# EAGLE design weatherstationv3 (EAGLE 6.0)
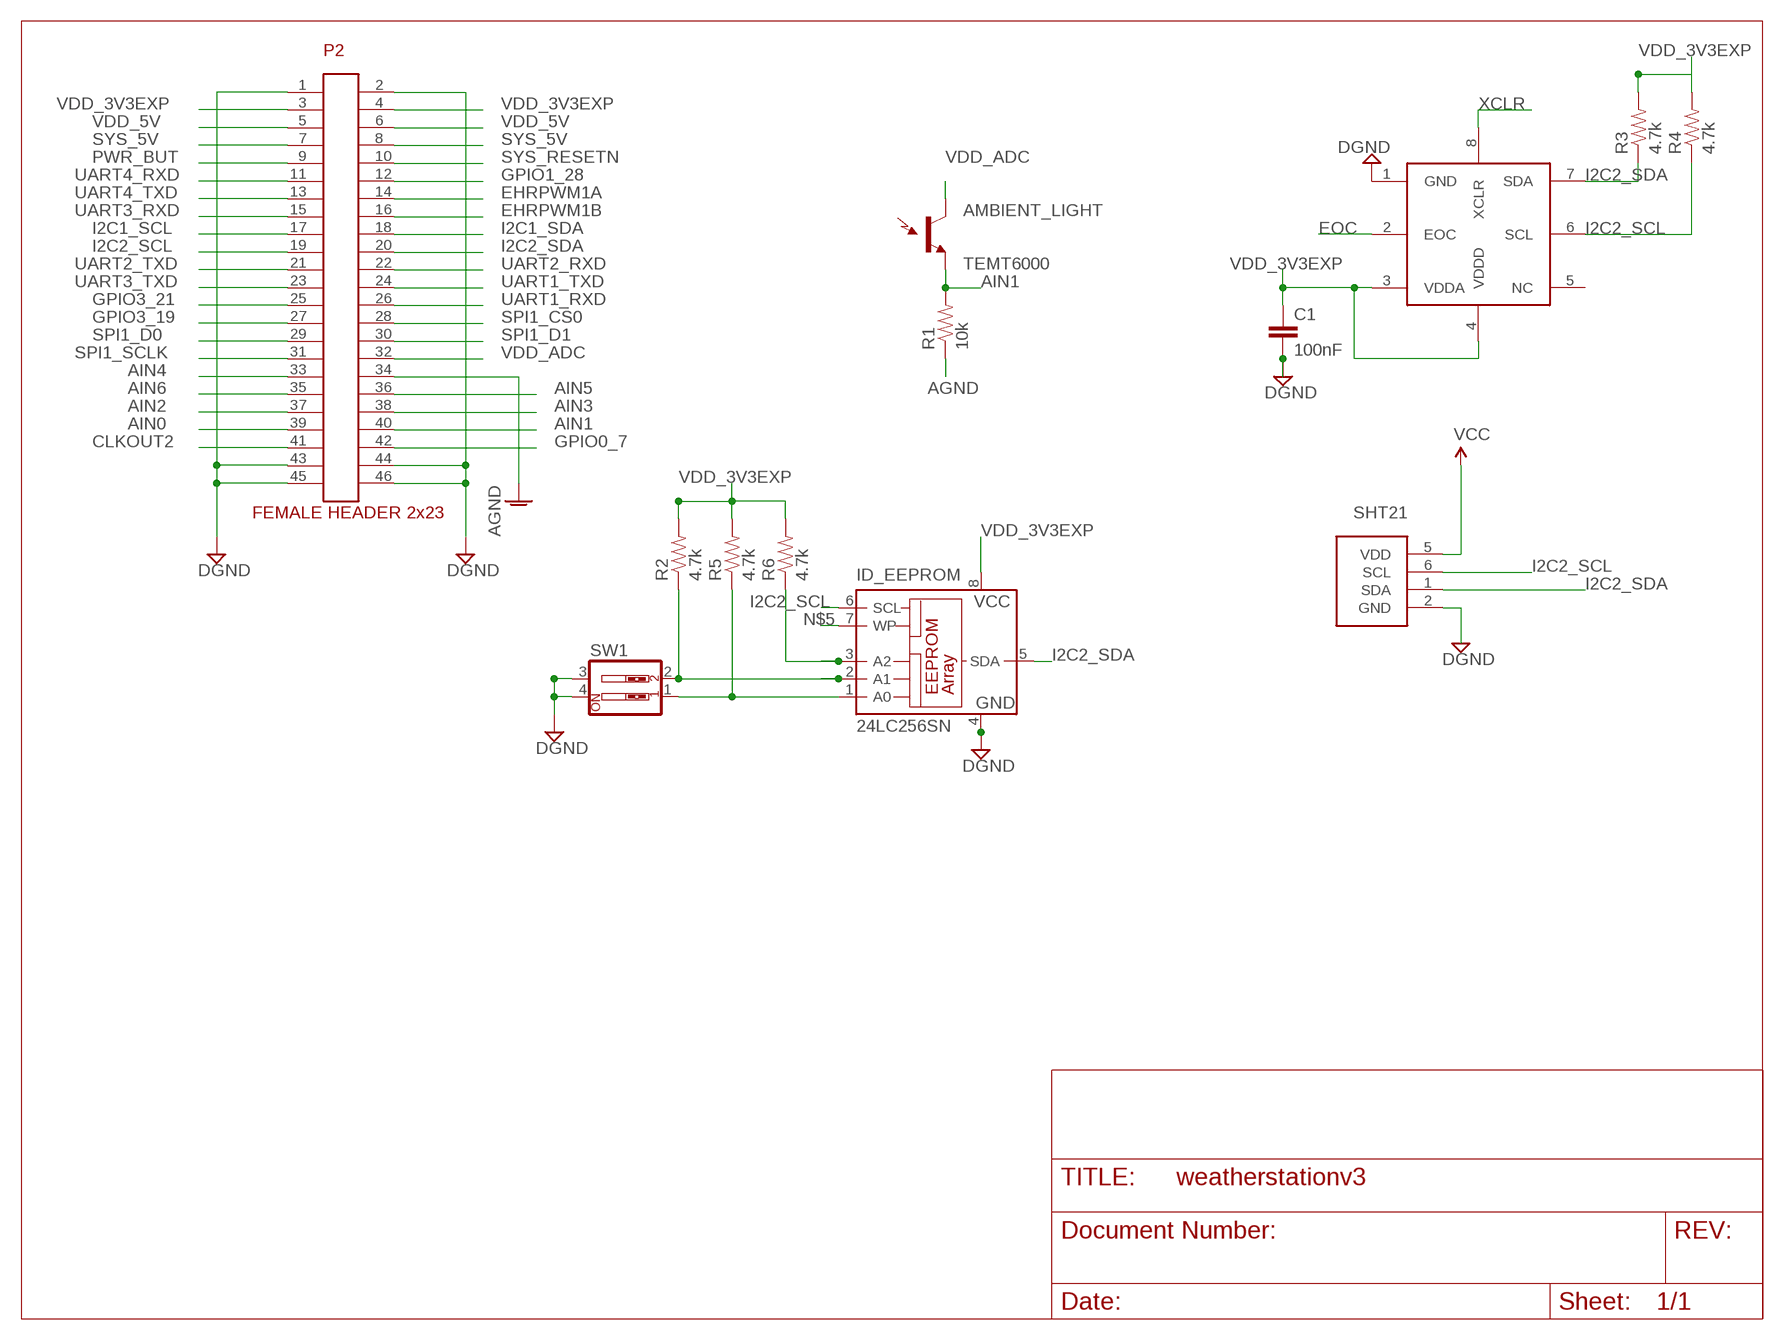
[diagram p0: schematic, sheet 1]

## Parts
AMBIENT_LIGHT  TEMT6000  [TEMT6000-SEN]
BAROMETRIC_PRESSURE  BMP085  [BMP085]
C1  100nF  CAP0603-CAP  [0603-CAP]
ID_EEPROM  24LC256SN  [SO-08]
P2  CONN23-2FB  [CONN23-2F]
R1  10k  RESISTOR0805-RES  [0805]
R2  4.7k  RESISTOR0603-RES  [0603-RES]
R3  4.7k  RESISTOR0603-RES  [0603-RES]
R4  4.7k  RESISTOR0603-RES  [0603-RES]
R5  4.7k  RESISTOR0603-RES  [0603-RES]
R6  4.7k  RESISTOR0603-RES  [0603-RES]
SHT21  SHT21  [SHT21]
SW1  SW_DIP-2  [DIPSWITCH-02]

## Nets
AGND: P2.34 R1.1
AIN0: P2.39
AIN1: AMBIENT_LIGHT.EMITTER(E1) P2.40 R1.2
AIN2: P2.37
AIN3: P2.38
AIN4: P2.33
AIN5: P2.36
AIN6: P2.35
CLKOUT2: P2.41
DGND [power]: BAROMETRIC_PRESSURE.1(GND) C1.2 P2.1 P2.2 P2.43 P2.44 P2.45 P2.46 SHT21.2(GND) SW1.3 SW1.4
EHRPWM1A: P2.14
EHRPWM1B: P2.16
EOC: BAROMETRIC_PRESSURE.2(EOC)
GPIO0_7: P2.42
GPIO1_28: P2.12
GPIO3_19: P2.27
GPIO3_21: P2.25
I2C1_SCL: P2.17
I2C1_SDA: P2.18
I2C2_SCL: BAROMETRIC_PRESSURE.6(SCL) ID_EEPROM.6(SCL) P2.19 R4.1 SHT21.6(SCL)
I2C2_SDA: BAROMETRIC_PRESSURE.7(SDA) ID_EEPROM.5(SDA) P2.20 R3.1 SHT21.1(SDA)
N$1: ID_EEPROM.1(A0) R5.1 SW1.1
N$5: ID_EEPROM.7(WP)
N$6: ID_EEPROM.3(A2) R6.1
N$7: ID_EEPROM.2(A1) R2.1 SW1.2
PWR_BUT: P2.9
SPI1_CS0: P2.28
SPI1_D0: P2.29
SPI1_D1: P2.30
SPI1_SCLK: P2.31
SYS_5V: P2.7 P2.8
SYS_RESETN: P2.10
UART1_RXD: P2.26
UART1_TXD: P2.24
UART2_RXD: P2.22
UART2_TXD: P2.21
UART3_RXD: P2.15
UART3_TXD: P2.23
UART4_RXD: P2.11
UART4_TXD: P2.13
VDD_3V3EXP [power]: BAROMETRIC_PRESSURE.3(VDDA) BAROMETRIC_PRESSURE.4(VDDD) C1.1 ID_EEPROM.8(VCC) P2.3 P2.4 R2.2 R3.2 R4.2 R5.2 R6.2 SHT21.5(VDD) ; supply symbol labelled VCC
VDD_5V: P2.5 P2.6
VDD_ADC [power]: AMBIENT_LIGHT.COLLECTOR(C1) P2.32
XCLR: BAROMETRIC_PRESSURE.8(XCLR)
Unconnected: BAROMETRIC_PRESSURE.5(NC)

## Power pins joined to a net without a drawn wire
DGND: ID_EEPROM.4(GND)

## Library data of the parts
AMBIENT_LIGHT = SparkFun:TEMT6000: Ambient Light Sensor Simple light detection sensor. Output varies with light intensity input. Spark Fun Electronics SKU : COM-08348
BAROMETRIC_PRESSURE = SparkFun:BMP085
C1 = SparkFun:CAP: Capacitor Standard 0603 ceramic capacitor, and 0.1" leaded capacitor.
ID_EEPROM = microchip:24*: Serial EEPROM I2C; MF: MICROCHIP; MPN: 24LC256-I/SN; OC_FARNELL: 9757996; OC_NEWARK: 27C9144
P2 = conn23-2f:CONN23-2FB: CONN23-2FB 2x23 pin female header
R1-R6 = SparkFun:RESISTOR: Resistor Basic schematic elements and footprints for 0603, 1206, and PTH resistors.
SHT21 = ALX:SHT21
SW1 = SparkFun:SW_DIP-2: DIP SWITCH

## Net classes
1 power: width 0.61 mm

## Board
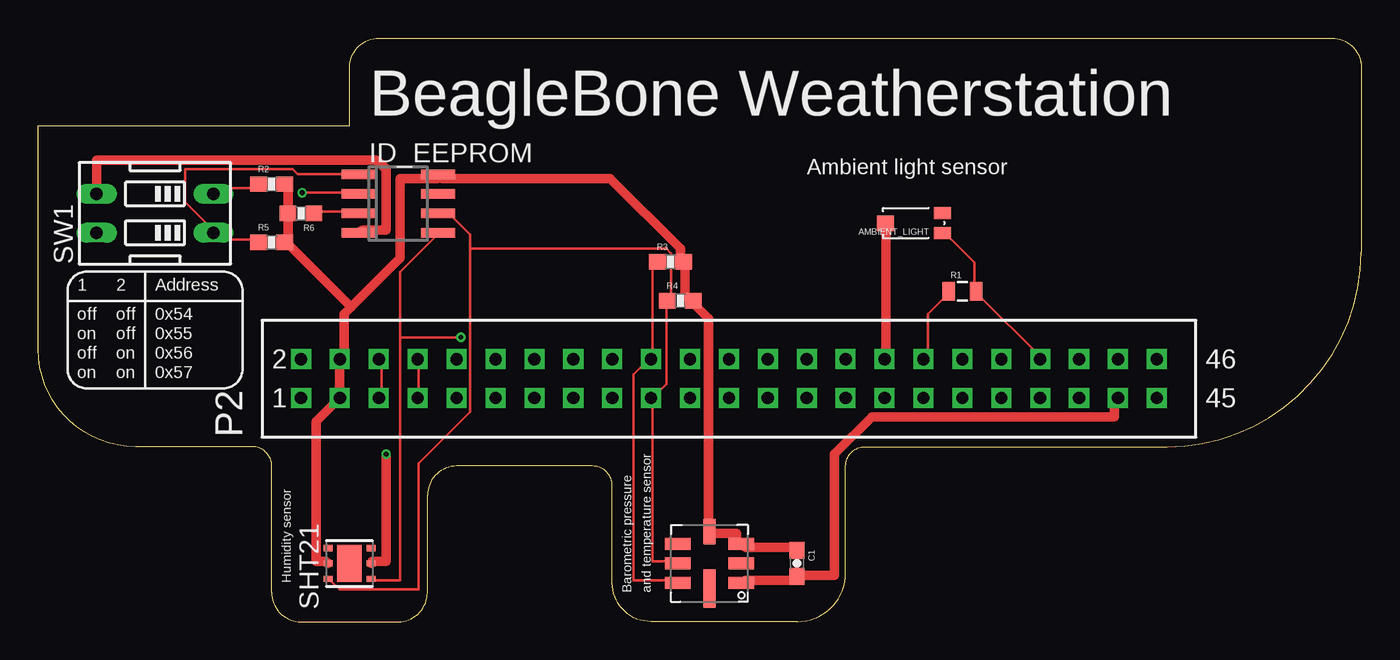
[diagram p1: board, top side]
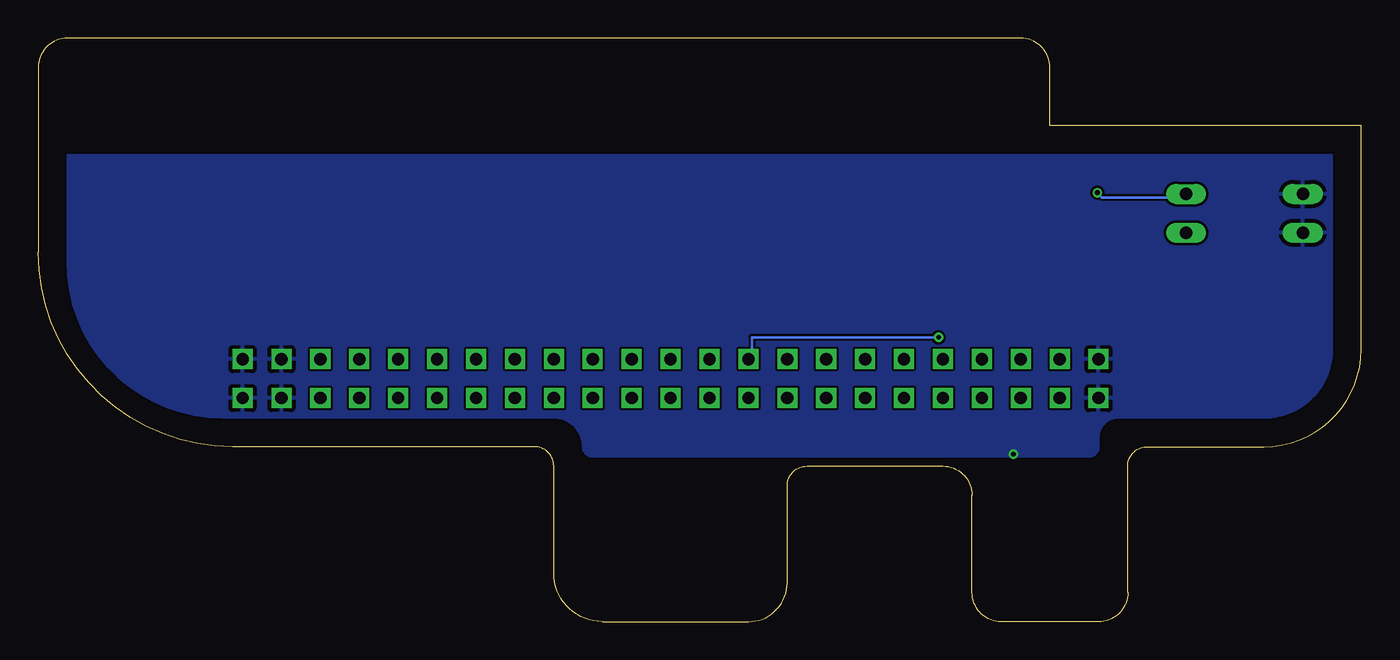
[diagram p2: board, bottom side, seen from below]

Size 86.36 x 38.1 mm. Coordinates in mm from the lower left corner, seen from the top.
Outline: 73.66,11.43 arc90 86.36,24.13 86.36,36.2 arc90 84.45,38.1 22.23,38.1 arc90 20.32,36.2 20.32,32.38 0,32.38 0,17.78 arc90 6.35,11.43 13.97,11.43 arc-90 15.24,10.16 15.24,1.9 arc90 17.14,0 23.5,0 arc90 25.4,1.9 25.4,8.26 arc-90 27.3,10.16 36.2,10.16 arc-90 37.46,8.89 37.46,2.54 arc90 40,0 49.53,0 arc90 52.7,3.17 52.7,10.16 arc-90 53.97,11.43 73.66,11.43
Copper layers (1*16): Top 0.035mm / dielectric 1.5mm / Bottom 0.035mm
Design rules: minimum track width 6mil, minimum drill 12mil, track to track 6mil, track to pad 6mil, pad to pad 6mil, via to via 6mil, smd to smd 0mil, copper to edge 10mil, drill to drill 10mil, minimum pad ring 10mil, minimum via ring 6mil, stop-mask expansion 2mil, vias tented up to drill 100mil, thermal gap 10mil

### Footprints (pad centres in the part's own frame; a part is rotated, then mirrored left to right if it is on the bottom)
TEMT6000-SEN = smd 1.1 x 0.8: BASE -1.87,-0.65; EMITTER -1.87,0.65 | smd 1.1 x 1: COLLECTOR 1.86,0.01
BMP085 = smd 1.67 x 0.8: 1 -2.065,1.27; 2 -2.065,0; 3 -2.065,-1.27; 5 2.065,-1.27; 6 2.065,0; 7 2.065,1.27 | smd 0.8 x 1.67: 4 0,-2.065 | smd 0.8 x 2.5: 8 0,1.65
0603-CAP = smd 1.1 x 1: 1 -0.85,0; 2 0.85,0
SO-08 = smd 0.6 x 2.2: 1 -1.905,-2.6; 2 -0.635,-2.6; 3 0.635,-2.6; 4 1.905,-2.6; 5 1.905,2.6; 6 0.635,2.6; 7 -0.635,2.6; 8 -1.905,2.6
CONN23-2F = drill 0.8 square: 1 -1.27,27.94; 2 1.27,27.94; 3 -1.27,25.4; 4 1.27,25.4; 5 -1.27,22.86; 6 1.27,22.86; 7 -1.27,20.32; 8 1.27,20.32; 9 -1.27,17.78; 10 1.27,17.78; 11 -1.27,15.24; 12 1.27,15.24; 13 -1.27,12.7; 14 1.27,12.7; 15 -1.27,10.16; 16 1.27,10.16; 17 -1.27,7.62; 18 1.27,7.62; 19 -1.27,5.08; 20 1.27,5.08; 21 -1.27,2.54; 22 1.27,2.54; 23 -1.27,0; 24 1.27,0; 25 -1.27,-2.54; 26 1.27,-2.54; 27 -1.27,-5.08; 28 1.27,-5.08; 29 -1.27,-7.62; 30 1.27,-7.62; 31 -1.27,-10.16; 32 1.27,-10.16; 33 -1.27,-12.7; 34 1.27,-12.7; 35 -1.27,-15.24; 36 1.27,-15.24; 37 -1.27,-17.78; 38 1.27,-17.78; 39 -1.27,-20.32; 40 1.27,-20.32; 41 -1.27,-22.86; 42 1.27,-22.86; 43 -1.27,-25.4; 44 1.27,-25.4; 45 -1.27,-27.94; 46 1.27,-27.94
0805 = smd 0.8 x 1.2: 1 -0.9,0; 2 0.9,0
0603-RES = smd 1.1 x 1: 1 -0.85,0; 2 0.85,0
SHT21 = smd 0.4 x 0.6: 1 -1,-1.4; 2 0,-1.4; 3 1,-1.4; 4 1,1.4; 5 0,1.4; 6 -1,1.4 | smd 2.4 x 1.6: P$7 0,0
DIPSWITCH-02 = drill 0.813 long: 1 -1.27,-3.81; 2 1.27,-3.81; 3 1.27,3.81; 4 -1.27,3.81

### Placement (x,y rotation side)
AMBIENT_LIGHT  57.15,26.03 180 top
BAROMETRIC_PRESSURE  43.81,3.81 180 top
C1  49.53,3.81 270 top
ID_EEPROM  23.5,27.3 270 top
P2  45.09,15.87 90 top
R1  60.33,21.59 0 top
R2  15.24,28.57 0 top
R3  41.27,23.49 0 top
R4  41.91,20.95 0 top
R5  15.24,24.77 0 top
R6  17.14,26.67 180 top
SHT21  20.32,3.81 90 top
SW1  7.62,26.67 90 top

### Tracks (layer width: path | path; a pad name or v marks a point on that pad's centre or on a via)
AGND
  Top 0.152: R1.1 59.28,21.31 58.06,20.09 58.06,17.35 P2.34
AIN1
  Top 0.152: AMBIENT_LIGHT.EMITTER 59.28,25.27 61.11,23.44 61.11,21.62 R1.2 61.42,21.31 65.38,17.35 P2.40
DGND  (via drill 0.3)
  Top 0.61: BAROMETRIC_PRESSURE.1 46.18,2.72 49.53,2.72 C1.2 49.53,3.02 51.97,3.02 51.97,10.95 54.41,13.39 70.26,13.39 70.26,14.6 P2.43 | v22.71,10.95 22.71,3.94 21.79,3.94 SHT21.2 | SW1.3 3.81,30.15 22.1,30.15 22.71,29.54 22.71,25.58 21.18,25.58 ID_EEPROM.4
  pour Bottom: 84.45,23.49 arc-90 74.3,13.33 53.97,13.33 52.7,13.33 arc90 50.8,11.43 arc-90 50.16,10.79 17.78,10.79 arc-90 17.14,11.43 17.14,12.06 arc90 15.87,13.33 6.35,13.33 arc-90 1.9,17.78 1.9,30.48 84.45,30.48
I2C2_SCL
  Top 0.152: 40.08,14.6 41,15.52 41,20.7 R4.1 41.3,21.01 41.3,24.05 41,24.36 28.19,24.36 | 40.08,14.6 40.08,3.94 41.6,3.94 BAROMETRIC_PRESSURE.6 | 40.08,14.6 P2.19 | 28.19,24.36 28.19,25.27 26.98,26.49 26.37,26.49 ID_EEPROM.6 | 28.19,24.36 28.19,13.69 24.84,10.34 24.84,2.11 19.66,2.11 19.05,2.72 SHT21.6
I2C2_SDA  (via drill 0.3)
  Top 0.152: R3.1 40.39,23.44 40.08,23.14 40.08,17.35 P2.20 39.78,17.04 38.86,16.13 38.86,2.72 41.6,2.72 BAROMETRIC_PRESSURE.7 | 23.62,18.57 23.62,22.84 26.06,25.27 ID_EEPROM.5 | 23.62,18.57 23.62,2.72 21.79,2.72 SHT21.1 | 23.62,18.57 v27.58,18.57
  Bottom 0.152: v27.58,18.57 39.78,18.57 39.78,17.35 P2.20
N$1
  Top 0.152: R5.1 14.17,24.97 11.43,24.97 SW1.1 11.43,25.58 9.6,27.41 9.6,29.54 16.61,29.54 16.92,29.23 20.88,29.23 ID_EEPROM.1
N$6
  Top 0.152: R6.1 18.14,26.8 20.88,26.8 ID_EEPROM.3
N$7  (via drill 0.3)
  Top 0.152: SW1.2 11.43,28.32 14.17,28.32 R2.1 | v17.22,28.02 20.88,28.02 ID_EEPROM.2
  Bottom 0.152: v17.22,28.02 16.92,27.71 11.43,27.71 SW1.2
SYS_5V
  Top 0.152: P2.7 24.84,14.6 24.84,17.04 P2.8
VDD_3V3EXP
  Top 0.61: C1.1 49.53,4.85 46.18,4.85 BAROMETRIC_PRESSURE.3 45.57,5.16 45.57,5.77 44.04,5.77 BAROMETRIC_PRESSURE.4 43.74,6.07 43.74,19.79 42.82,20.7 R4.2 42.52,21.01 42.21,21.31 42.21,23.44 R3.2 41.91,23.75 41.91,24.36 37.34,28.93 26.37,28.93 ID_EEPROM.8 26.06,28.93 23.62,28.93 23.62,23.75 20.42,20.55 | 19.66,14.6 18.14,13.08 18.14,3.94 18.75,3.94 SHT21.5 | R2.2 16.31,28.32 16.31,26.8 R6.2 16.31,26.49 16.31,24.97 R5.2 16.31,24.66 20.42,20.55 | 20.42,20.55 19.96,20.09 19.96,17.35 P2.4 19.66,17.04 19.66,14.6 | 19.66,14.6 P2.3
VDD_5V
  Top 0.152: P2.5 22.4,14.6 22.4,17.04 P2.6
VDD_ADC
  Top 0.61: AMBIENT_LIGHT.COLLECTOR 55.32,25.88 55.32,17.35 P2.32

### Text on the board
tPlace: BeagleBone Weatherstation | Ambient light sensor | 1 | 2 | Address | off | off | 0x54 | on | off | 0x55 | off | on | 0x56 | 2 | 46 | on | on | 0x57 | 1 | 45 | Humidity sensor | Barometric pressure | and temperature sensor